# Altium project X1000_BB.PrjPCB
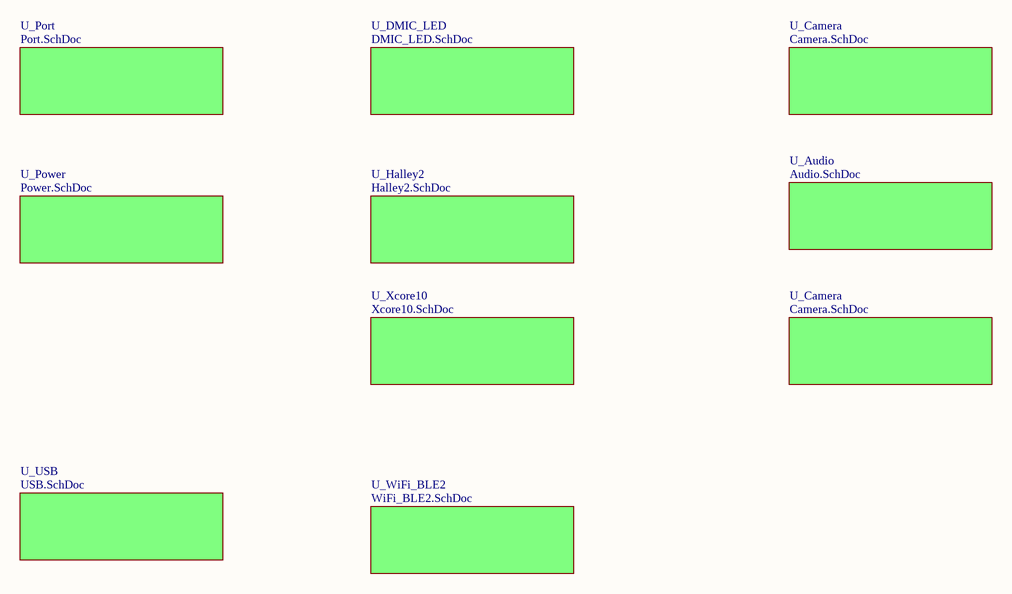
[diagram p0: X1000_BB.SchDoc]
10 sheets, 77 parts. Net scope: global (net labels, ports and power ports of the same name join across sheets).
Board file: X1000_BB.PcbDoc
Sheets:
  X1000_BB.SchDoc
    U_Camera = Camera.SchDoc
    U_Audio = Audio.SchDoc
    U_Camera = Camera.SchDoc
    U_DMIC_LED = DMIC_LED.SchDoc
    U_Halley2 = Halley2.SchDoc
    U_Port = Port.SchDoc
    U_Power = Power.SchDoc
    U_USB = USB.SchDoc
    U_WiFi_BLE2 = WiFi_BLE2.SchDoc
    U_Xcore10 = Xcore10.SchDoc

## Sheet X1000_BB.SchDoc
size A

### Sub-sheets
U_Audio = Audio.SchDoc: no entries
U_Camera = Camera.SchDoc: no entries
U_Camera = Camera.SchDoc: no entries
U_DMIC_LED = DMIC_LED.SchDoc: no entries
U_Halley2 = Halley2.SchDoc: no entries
U_Port = Port.SchDoc: no entries
U_Power = Power.SchDoc: no entries
U_USB = USB.SchDoc: no entries
U_WiFi_BLE2 = WiFi_BLE2.SchDoc: no entries
U_Xcore10 = Xcore10.SchDoc: no entries

## Sheet Camera.SchDoc
size A
Used 2 times, as channels U_Camera, U_Camera. Parts and nets are listed once, with the designators drawn on the sheet.
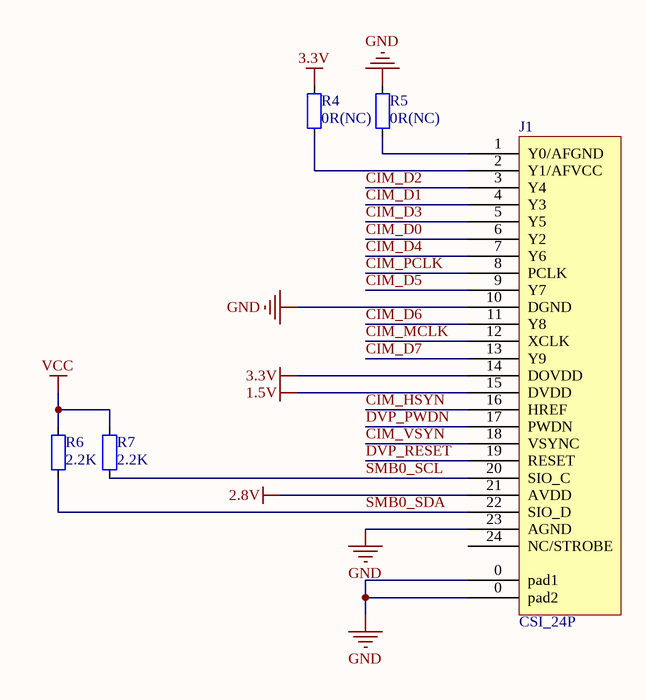
[diagram p1: Camera.SchDoc]

### Parts
J1  CSI_24P  [FFC_0.5_24]
R4  value 0R(NC)  [RES_0402]  (hidden comment: Res_0402)
R5  value 0R(NC)  [RES_0402]  (hidden comment: Res_0402)
R6  value 2.2K  [RES_0402]  (hidden comment: Res_0402)
R7  value 2.2K  [RES_0402]  (hidden comment: Res_0402)

### Nets
1.5V: J1.15(DVDD)
2.8V: J1.21(AVDD)
3.3V: J1.14(DOVDD) R4.2
GND: J1.0(pad1) J1.10(DGND) J1.23(AGND) R5.2
VCC: R6.2 R7.2
CIM_D0: J1.6(Y2)
CIM_D1: J1.4(Y3)
CIM_D2: J1.3(Y4)
CIM_D3: J1.5(Y5)
CIM_D4: J1.7(Y6)
CIM_D5: J1.9(Y7)
CIM_D6: J1.11(Y8)
CIM_D7: J1.13(Y9)
CIM_HSYN: J1.16(HREF)
CIM_MCLK: J1.12(XCLK)
CIM_PCLK: J1.8(PCLK)
CIM_VSYN: J1.18(VSYNC)
DVP_PWDN: J1.17(PWDN)
DVP_RESET: J1.19(RESET)
SMB0_SCL: J1.20(SIO_C) R7.1
SMB0_SDA: J1.22(SIO_D) R6.1
NetJ1_1: J1.1(Y0/AFGND) R5.1
NetJ1_2: J1.2(Y1/AFVCC) R4.1

Not connected (* = marked no-connect by the designer): J1 24(NC/STROBE)

### Channels
U_Camera: designators end in _U_Camera#1
U_Camera: designators end in _U_Camera#2

### Library data of the parts
R4-R7 = Res_0402: Resistor

## Sheet Audio.SchDoc
size A
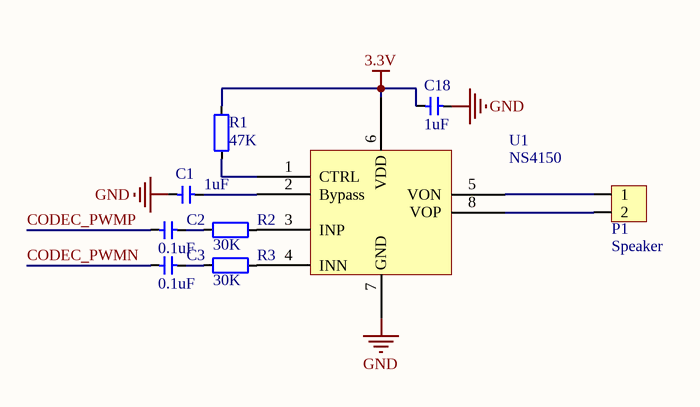
[diagram p2: Audio.SchDoc]

### Parts
C1  value 1uF  [CAP_0402]  (hidden comment: Cap_0402)
C2  value 0.1uF  [CAP_0402]  (hidden comment: Cap_0402)
C3  value 0.1uF  [CAP_0402]  (hidden comment: Cap_0402)
C18  value 1uF  [CAP_0402]  (hidden comment: Cap_0402)
P1  Speaker  [HDR1X2_2.54_180]
R1  value 47K  [RES_0402]  (hidden comment: Res_0402)
R2  value 30K  [RES_0402]  (hidden comment: Res_0402)
R3  value 30K  [RES_0402]  (hidden comment: Res_0402)
U1  NS4150  [SOP_E150_8]

### Nets
3.3V: C18.2 R1.2 U1.6(VDD)
GND: C1.1 C18.1
CODEC_PWMN: C3.1
CODEC_PWMP: C2.1
NetC1_2: C1.2 U1.2(Bypass)
NetC2_2: C2.2 R2.2
NetC3_2: C3.2 R3.2
NetP1_1: P1.1 U1.5(VON)
NetP1_2: P1.2 U1.8(VOP)
NetR1_1: R1.1 U1.1(CTRL)
NetR2_1: R2.1 U1.3(INP)
NetR3_1: R3.1 U1.4(INN)

Not connected (* = marked no-connect by the designer): U1 7(GND)

### Notes on the sheet
- Labels drawn without touching a wire or pin: GND

### Library data of the parts
C1-C3 C18 = Cap_0402: Capacitor
P1 = HDR1x2_2.54: Header
R1-R3 = Res_0402: Resistor
U1 = NS4150: D Class Audio Amp

## Sheet DMIC_LED.SchDoc
size A
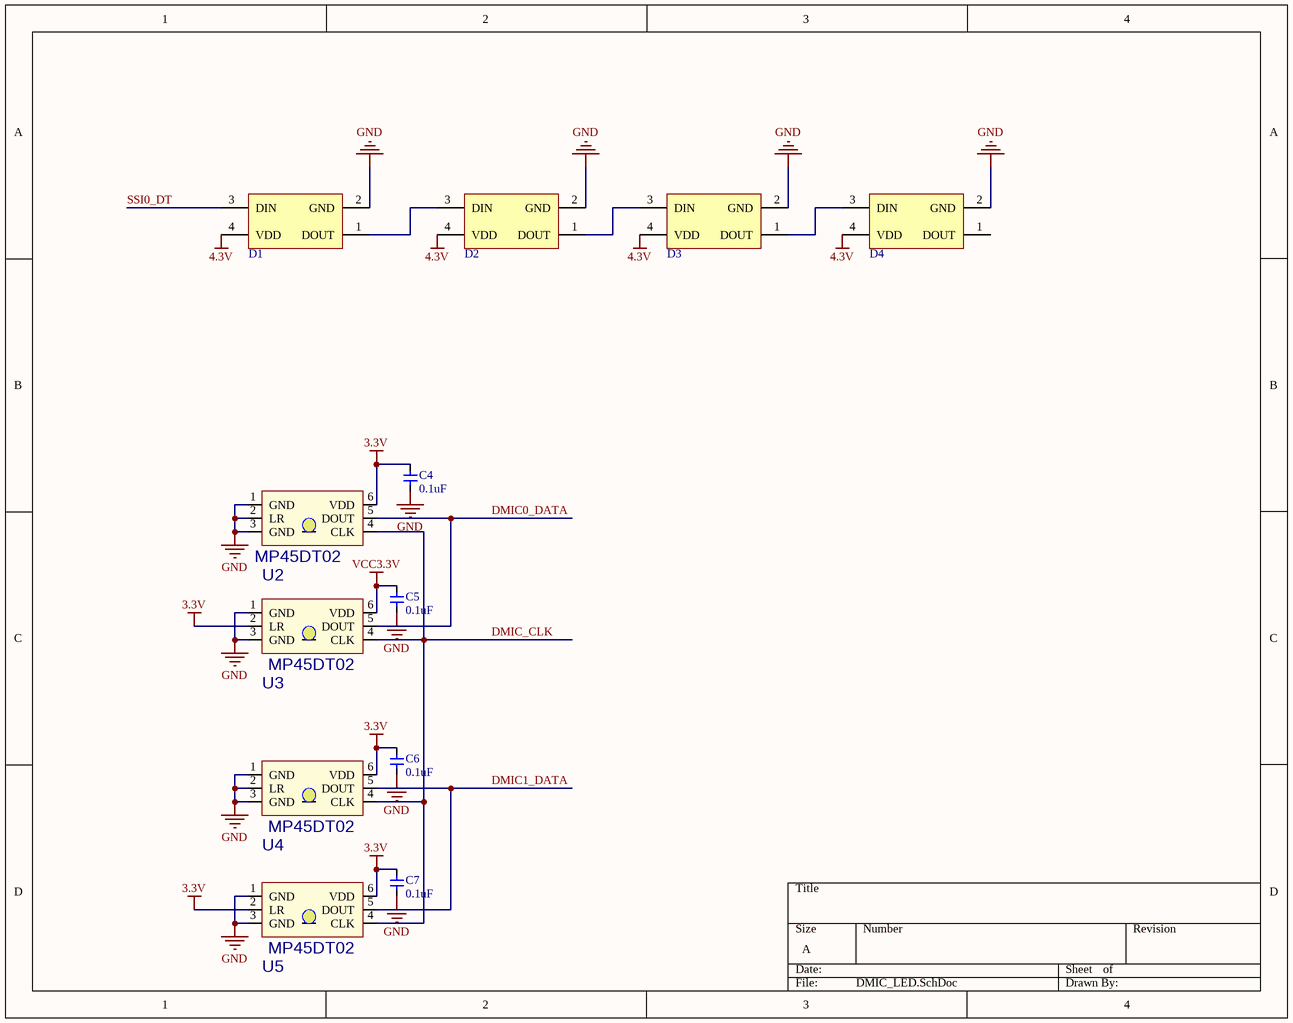
[diagram p3: DMIC_LED.SchDoc]

### Parts
C4  value 0.1uF  [CAP_0603]  (hidden comment: Cap_0603)
C5  value 0.1uF  [CAP_0603]  (hidden comment: Cap_0603)
C6  value 0.1uF  [CAP_0603]  (hidden comment: Cap_0603)
C7  value 0.1uF  [CAP_0603]  (hidden comment: Cap_0603)
D1  LED_3535_SK6812  [LED_3535_4P]  (value not drawn)
D2  LED_3535_SK6812  [LED_3535_4P]  (value not drawn)
D3  LED_3535_SK6812  [LED_3535_4P]  (value not drawn)
D4  LED_3535_SK6812  [LED_3535_4P]  (value not drawn)
U2  MP45DT02  [ST_HLGA6]
U3  MP45DT02  [ST_HLGA6]
U4  MP45DT02  [ST_HLGA6]
U5  MP45DT02  [ST_HLGA6]

### Nets
3.3V: C4.2 C6.2 C7.2 U2.6(VDD) U3.2(LR) U4.6(VDD) U5.2(LR) U5.6(VDD)
4.3V: D1.4(VDD) D2.4(VDD) D3.4(VDD) D4.4(VDD)
GND: C4.1 C5.1 C6.1 C7.1 D1.2(GND) D2.2(GND) D3.2(GND) D4.2(GND) U2.1(GND) U2.2(LR) U2.3(GND) U3.1(GND) U3.3(GND) U4.1(GND) U4.2(LR) U4.3(GND) U5.1(GND) U5.3(GND)
VCC3.3V: C5.2 U3.6(VDD)
DMIC0_DATA: U2.5(DOUT) U3.5(DOUT)
DMIC1_DATA: U4.5(DOUT) U5.5(DOUT)
DMIC_CLK: U2.4(CLK) U3.4(CLK) U4.4(CLK) U5.4(CLK)
SSI0_DT: D1.3(DIN)
NetD1_1: D1.1(DOUT) D2.3(DIN)
NetD2_1: D2.1(DOUT) D3.3(DIN)
NetD3_1: D3.1(DOUT) D4.3(DIN)

Not connected (* = marked no-connect by the designer): D4 1(DOUT)

### Library data of the parts
C4-C7 = Cap_0603: Capacitor
D1-D4 = LED_3535_SK6812: LED
U2-U5 = MP45DT02: Mic Omni-Directional -26dB 3.6V Rectangular Solder Pad; MF: STMicroelectronics; MP: MP45DT02; Package: None; Availability: Good; Price: 2.57 USD; Value: *

## Sheet Halley2.SchDoc
size A
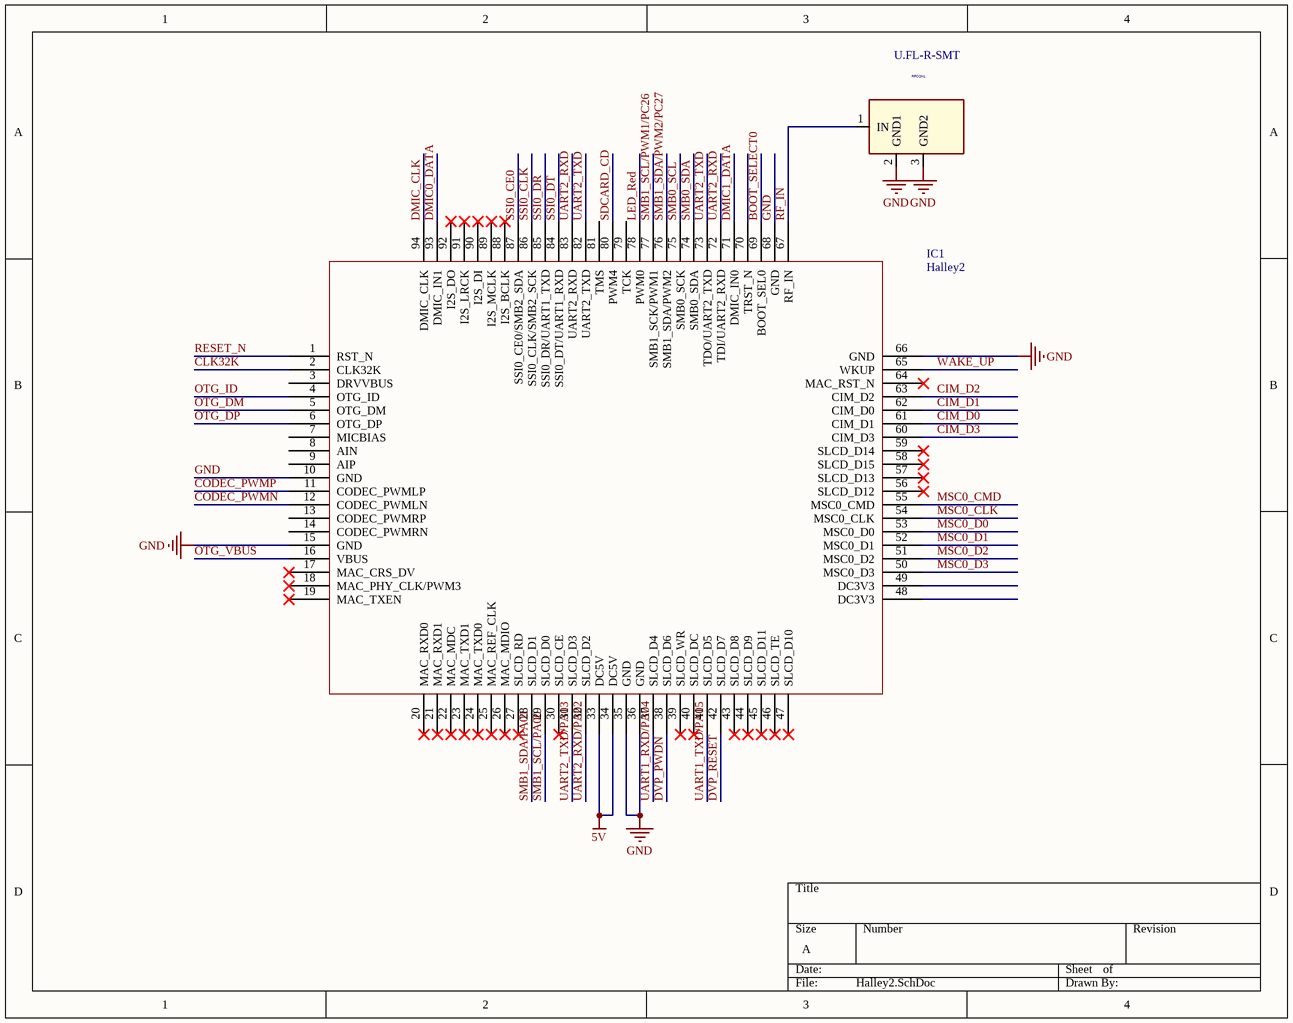
[diagram p4: Halley2.SchDoc]

### Parts
IC1  Halley2  [Halley2]
RFCON1  U.FL-R-SMT  [ANTENNA_DN007N]

### Nets
5V: IC1.33(DC5V) IC1.34(DC5V)
GND: IC1.10(GND) IC1.15(GND) IC1.35(GND) IC1.36(GND) IC1.66(GND) IC1.68(GND) RFCON1.2(GND1) RFCON1.3(GND2)
OTG_VBUS: IC1.16(VBUS)
BOOT_SELECT0: IC1.69(BOOT_SEL0)
CIM_D0: IC1.61(CIM_D1)
CIM_D1: IC1.62(CIM_D0)
CIM_D2: IC1.63(CIM_D2)
CIM_D3: IC1.60(CIM_D3)
CLK32K: IC1.2(CLK32K)
CODEC_PWMN: IC1.12(CODEC_PWMLN)
CODEC_PWMP: IC1.11(CODEC_PWMLP)
DMIC0_DATA: IC1.93(DMIC_IN1)
DMIC1_DATA: IC1.71(DMIC_IN0)
DMIC_CLK: IC1.94(DMIC_CLK)
DVP_PWDN: IC1.38(SLCD_D6)
DVP_RESET: IC1.42(SLCD_D7)
LED_Red: IC1.78(PWM0)
MSC0_CLK: IC1.54(MSC0_CLK)
MSC0_CMD: IC1.55(MSC0_CMD)
MSC0_D0: IC1.53(MSC0_D0)
MSC0_D1: IC1.52(MSC0_D1)
MSC0_D2: IC1.51(MSC0_D2)
MSC0_D3: IC1.50(MSC0_D3)
OTG_DM: IC1.5(OTG_DM)
OTG_DP: IC1.6(OTG_DP)
OTG_ID: IC1.4(OTG_ID)
RESET_N: IC1.1(RST_N)
RF_IN: IC1.67(RF_IN) RFCON1.1(IN)
SDCARD_CD: IC1.80(PWM4)
SMB0_SCL: IC1.75(SMB0_SCK)
SMB0_SDA: IC1.74(SMB0_SDA)
SMB1_SCL/PA00: IC1.29(SLCD_D0)
SMB1_SCL/PWM1/PC26: IC1.77(SMB1_SCK/PWM1)
SMB1_SDA/PA01: IC1.28(SLCD_D1)
SMB1_SDA/PWM2/PC27: IC1.76(SMB1_SDA/PWM2)
SSI0_CE0: IC1.87(SSI0_CE0/SMB2_SDA)
SSI0_CLK: IC1.86(SSI0_CLK/SMB2_SCK)
SSI0_DR: IC1.85(SSI0_DR/UART1_TXD)
SSI0_DT: IC1.84(SSI0_DT/UART1_RXD)
UART1_RXD/PA04: IC1.37(SLCD_D4)
UART1_TXD/PA05: IC1.41(SLCD_D5)
UART2_RXD: IC1.72(TDI/UART2_RXD) IC1.83(UART2_RXD)
UART2_RXD/PA02: IC1.32(SLCD_D2)
UART2_TXD: IC1.73(TDO/UART2_TXD) IC1.82(UART2_TXD)
UART2_TXD/PA03: IC1.31(SLCD_D3)
WAKE_UP: IC1.65(WKUP)

Not connected (* = marked no-connect by the designer): IC1 3(DRVVBUS) 7(MICBIAS) 8(AIN) 9(AIP) 13(CODEC_PWMRP) 14(CODEC_PWMRN) 17(MAC_CRS_DV)* 18(MAC_PHY_CLK/PWM3)* 19(MAC_TXEN)* 20(MAC_RXD0)* 21(MAC_RXD1)* 22(MAC_MDC)* 23(MAC_TXD1)* 24(MAC_TXD0)* 25(MAC_REF_CLK)* 26(MAC_MDIO)* 27(SLCD_RD)* 30(SLCD_CE)* 39(SLCD_WR)* 40(SLCD_DC)* 43(SLCD_D8)* 44(SLCD_D9)* 45(SLCD_D11)* 46(SLCD_TE)* 47(SLCD_D10)* 48(DC3V3) 49(DC3V3) 56(SLCD_D12)* 57(SLCD_D13)* 58(SLCD_D15)* 59(SLCD_D14)* 64(MAC_RST_N)* 70(TRST_N) 79(TCK) 81(TMS) 88(I2S_BCLK)* 89(I2S_MCLK)* 90(I2S_DI)* 91(I2S_LRCK)* 92(I2S_DO)*

### Library data of the parts
RFCON1 = ANT_0: 1ST PART DESCRIPTION: U.FL-R-SMT

## Sheet Port.SchDoc
size A
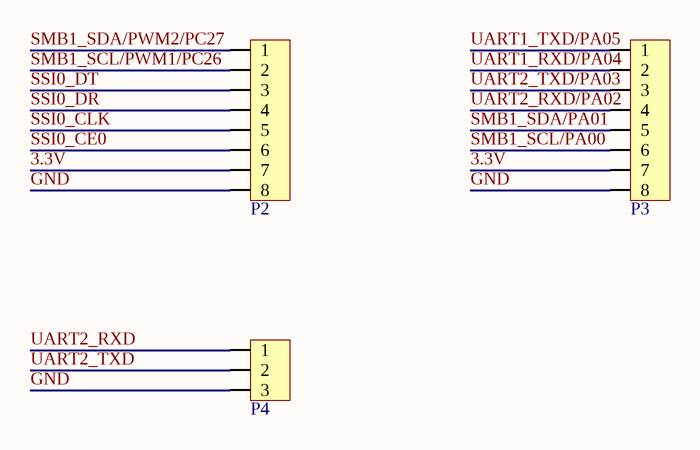
[diagram p5: Port.SchDoc]

### Parts
P2  HDR1x8_2.54  [HDR1X8_2.54_180]  (value not drawn)
P3  HDR1x8_2.54  [HDR1X8_2.54_180]  (value not drawn)
P4  HDR1x3_2.54  [HDR1X3_2.54_180]  (value not drawn)

### Nets
3.3V: P2.7 P3.7
GND: P2.8 P3.8 P4.3
SMB1_SCL/PA00: P3.6
SMB1_SCL/PWM1/PC26: P2.2
SMB1_SDA/PA01: P3.5
SMB1_SDA/PWM2/PC27: P2.1
SSI0_CE0: P2.6
SSI0_CLK: P2.5
SSI0_DR: P2.4
SSI0_DT: P2.3
UART1_RXD/PA04: P3.2
UART1_TXD/PA05: P3.1
UART2_RXD: P4.1
UART2_RXD/PA02: P3.4
UART2_TXD: P4.2
UART2_TXD/PA03: P3.3

### Library data of the parts
P2 P3 = HDR1x8_2.54: Header
P4 = HDR1x3_2.54: Header

## Sheet Power.SchDoc
size A
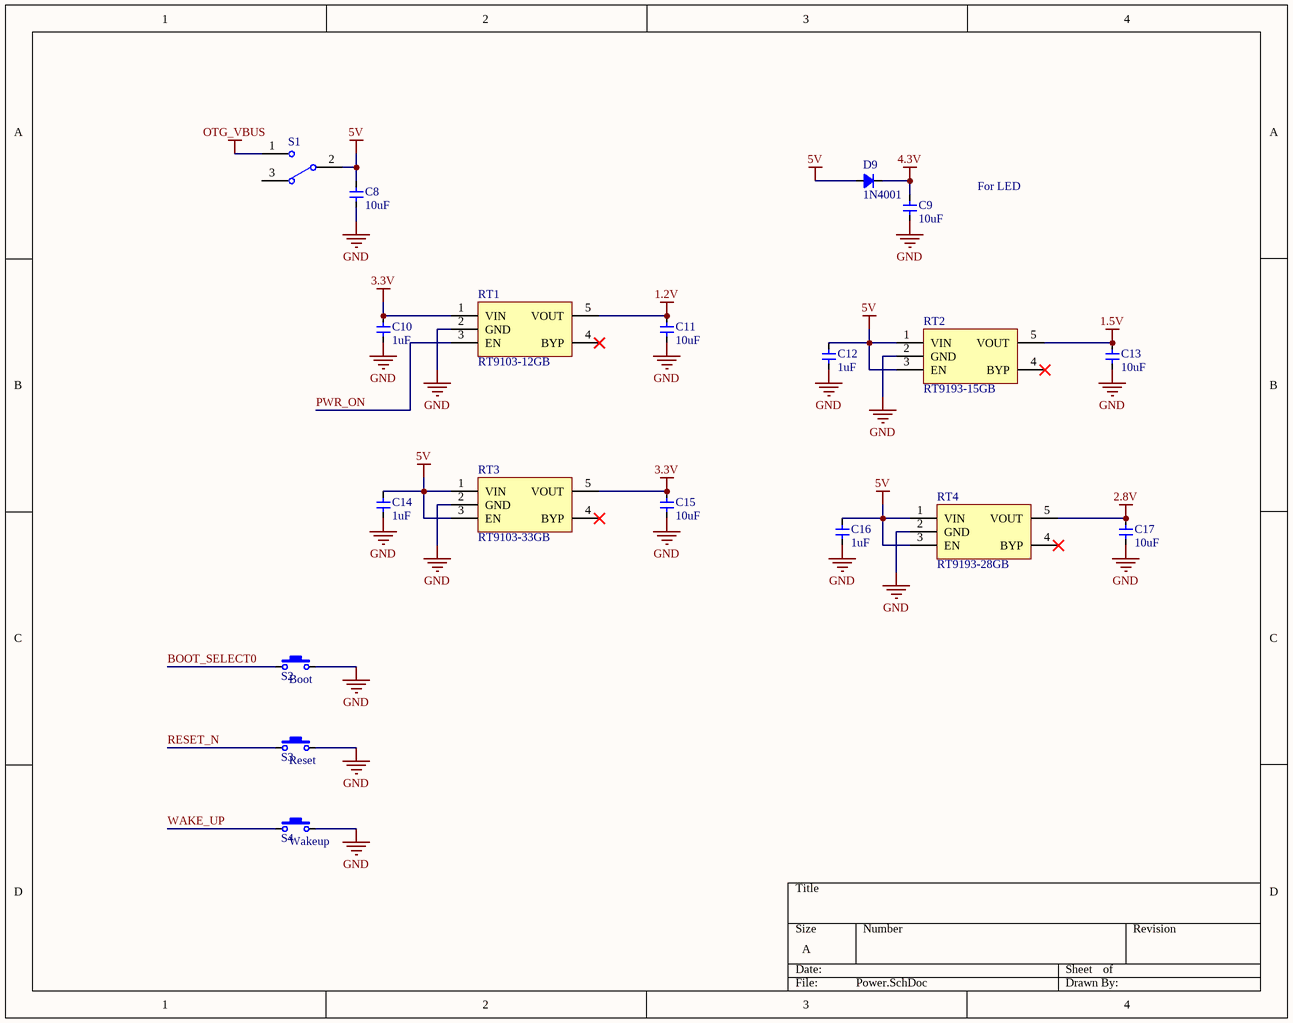
[diagram p6: Power.SchDoc]

### Parts
C8  value 10uF  [CAP_0805]  (hidden comment: Cap_0805)
C9  value 10uF  [CAP_0805]  (hidden comment: Cap_0805)
C10  value 1uF  [CAP_0402]  (hidden comment: Cap_0402)
C11  value 10uF  [CAP_0805]  (hidden comment: Cap_0805)
C12  value 1uF  [CAP_0402]  (hidden comment: Cap_0402)
C13  value 10uF  [CAP_0805]  (hidden comment: Cap_0805)
C14  value 1uF  [CAP_0402]  (hidden comment: Cap_0402)
C15  value 10uF  [CAP_0805]  (hidden comment: Cap_0805)
C16  value 1uF  [CAP_0402]  (hidden comment: Cap_0402)
C17  value 10uF  [CAP_0805]  (hidden comment: Cap_0805)
D9  value 1N4001  [DO-214AC]  (hidden comment: IN4001)
RT1  RT9103-12GB  [SOT23-5]
RT2  RT9193-15GB  [SOT23-5]
RT3  RT9103-33GB  [SOT23-5]
RT4  RT9193-28GB  [SOT23-5]
S1  SwitchSPDT_2.8x6.6_90  [SwitchSPDT_2.8X6.6_90]  (value not drawn)
S2  Boot  [ButtonTACT_3x4x2_180H]
S3  Reset  [ButtonTACT_3x4x2_180H]
S4  Wakeup  [ButtonTACT_3x4x2_180H]

### Nets
1.2V: C11.2 RT1.5(VOUT)
1.5V: C13.2 RT2.5(VOUT)
2.8V: C17.2 RT4.5(VOUT)
3.3V: C10.2 C15.2 RT1.1(VIN) RT3.5(VOUT)
4.3V: C9.2 D9.2(K)
5V: C8.2 C12.2 C14.2 C16.2 D9.1(A) RT2.1(VIN) RT2.3(EN) RT3.1(VIN) RT3.3(EN) RT4.1(VIN) RT4.3(EN) S1.2
GND: C8.1 C9.1 C10.1 C11.1 C12.1 C13.1 C14.1 C15.1 C16.1 C17.1 RT1.2(GND) RT2.2(GND) RT3.2(GND) RT4.2(GND) S2.2 S3.2 S4.2
OTG_VBUS: S1.1
BOOT_SELECT0: S2.1
PWR_ON: RT1.3(EN)
RESET_N: S3.1
WAKE_UP: S4.1

Not connected (* = marked no-connect by the designer): RT1 4(BYP)*; RT2 4(BYP)*; RT3 4(BYP)*; RT4 4(BYP)*; S1 3

### Notes on the sheet
- For LED

### Library data of the parts
C8 C9 C11 C13 C15 C17 = Cap_0805: Capacitor
C10 C12 C14 C16 = Cap_0402: Capacitor
D9 = Diode_SMA: Diode
RT1-RT4 = RT9193: Power
S1 = SwitchSPDT_2.8x6.6_90: Switch
S2-S4 = ButtonTACT_3x4x2_180: Button

## Sheet USB.SchDoc
size A
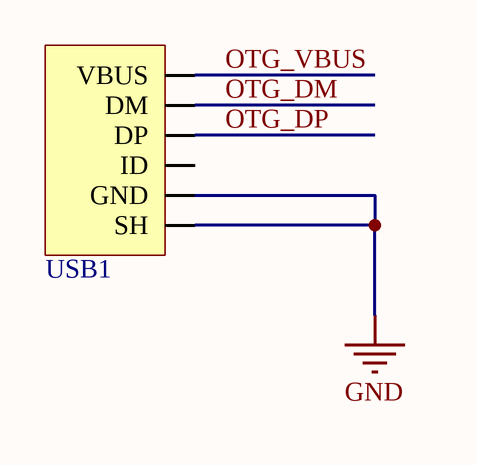
[diagram p7: USB.SchDoc]

### Parts
USB1  USB_Micro  [USB_Micro-AB]  (value not drawn)

### Nets
GND: USB1.0(SH) USB1.5(GND)
OTG_VBUS: USB1.1(VBUS)
OTG_DM: USB1.2(DM)
OTG_DP: USB1.3(DP)

Not connected (* = marked no-connect by the designer): USB1 4(ID)

### Library data of the parts
USB1 = USB_Micro: USB

## Sheet WiFi_BLE2.SchDoc
size A
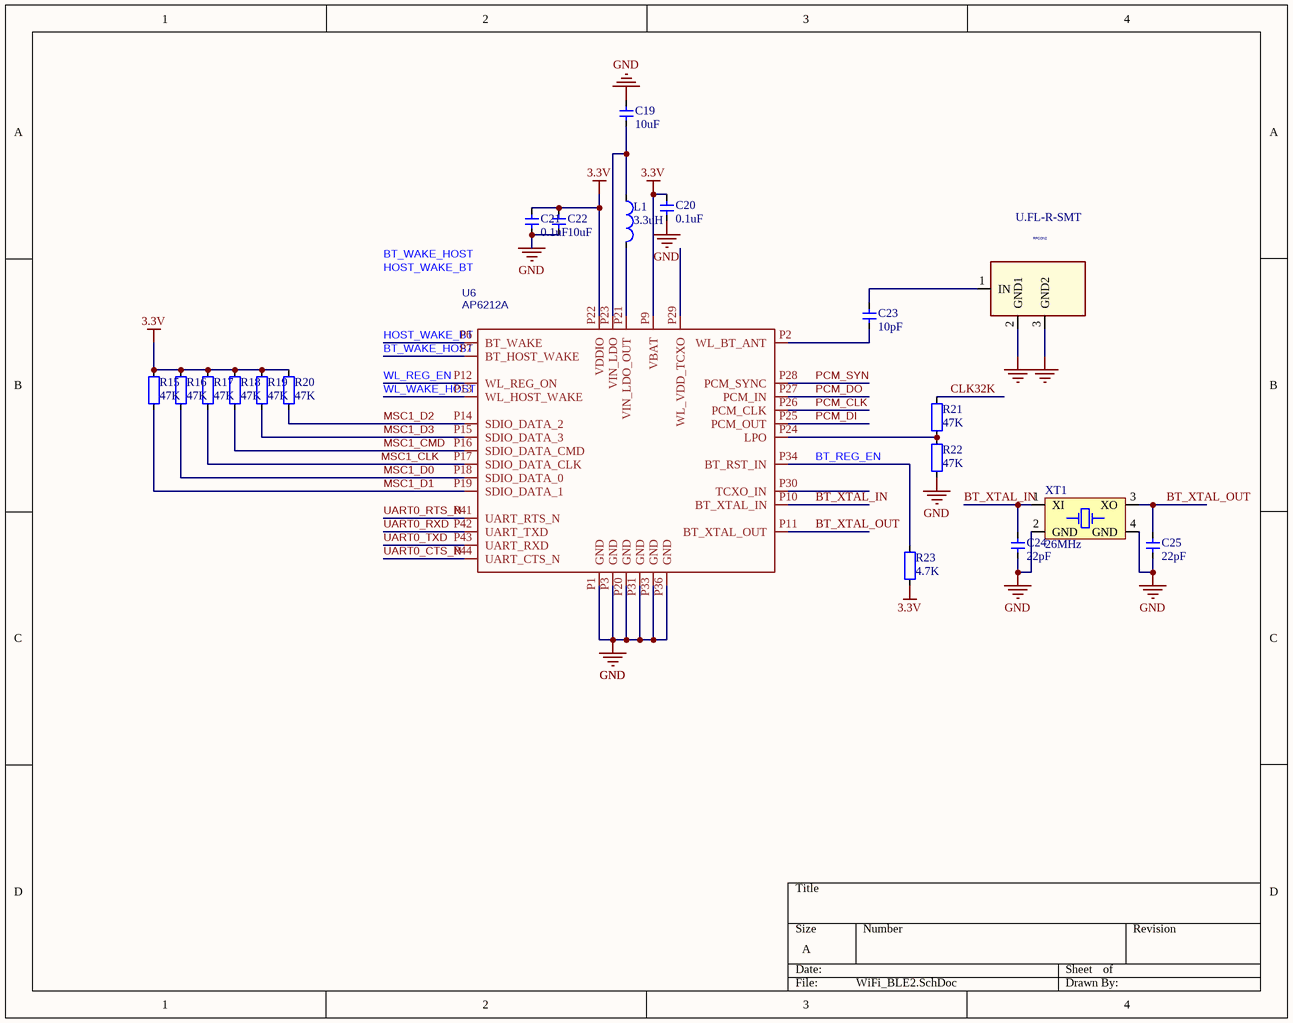
[diagram p8: WiFi_BLE2.SchDoc]

### Parts
C19  value 10uF  [CAP_0805]  (hidden comment: Cap_0805)
C20  value 0.1uF  [CAP_0402]  (hidden comment: Cap_0402)
C21  value 0.1uF  [CAP_0402]  (hidden comment: Cap_0402)
C22  value 10uF  [CAP_0805]  (hidden comment: Cap_0805)
C23  value 10pF  [CAP_0402]  (hidden comment: Cap_0402)
C24  value 22pF  [CAP_0402]  (hidden comment: Cap_0402)
C25  value 22pF  [CAP_0402]  (hidden comment: Cap_0402)
L1  value 3.3uH  [IND_0402]  (hidden comment: Ind_0402)
R15  value 47K  [RES_0402]  (hidden comment: Res_0402)
R16  value 47K  [RES_0402]  (hidden comment: Res_0402)
R17  value 47K  [RES_0402]  (hidden comment: Res_0402)
R18  value 47K  [RES_0402]  (hidden comment: Res_0402)
R19  value 47K  [RES_0402]  (hidden comment: Res_0402)
R20  value 47K  [RES_0402]  (hidden comment: Res_0402)
R21  value 47K  [RES_0402]  (hidden comment: Res_0402)
R22  value 47K  [RES_0402]  (hidden comment: Res_0402)
R23  value 4.7K  [RES_0402]  (hidden comment: Res_0402)
RFCON2  U.FL-R-SMT  [ANTENNA_DN007N]
U6  AP6212A  [AP6210]
XT1  value 26MHz  [XT_3225_4]  (hidden comment: XTAL_3225_4P)

### Nets
3.3V: C20.2 C21.2 C22.2 R15.2 R16.2 R17.2 R18.2 R19.2 R20.2 R23.1 U6.P9(VBAT) U6.P22(VDDIO)
GND: C19.2 C20.1 C21.1 C22.1 C24.1 C25.1 R22.1 RFCON2.2(GND1) RFCON2.3(GND2) U6.P1(GND) U6.P3(GND) U6.P20(GND) U6.P31(GND) U6.P33(GND) U6.P36(GND) XT1.2(GND) XT1.4(GND)
BT_REG_EN: R23.2 U6.P34(BT_RST_IN)
BT_WAKE_HOST: U6.P7(BT_HOST_WAKE)
BT_XTAL_IN: C24.2 U6.P10(BT_XTAL_IN) XT1.1(XI)
BT_XTAL_OUT: C25.2 U6.P11(BT_XTAL_OUT) XT1.3(XO)
CLK32K: R21.2
HOST_WAKE_BT: U6.P6(BT_WAKE)
MSC1_CLK: R17.1 U6.P17(SDIO_DATA_CLK)
MSC1_CMD: R18.1 U6.P16(SDIO_DATA_CMD)
MSC1_D0: R16.1 U6.P18(SDIO_DATA_0)
MSC1_D1: R15.1 U6.P19(SDIO_DATA_1)
MSC1_D2: R20.1 U6.P14(SDIO_DATA_2)
MSC1_D3: R19.1 U6.P15(SDIO_DATA_3)
PCM_CLK: U6.P26(PCM_CLK)
PCM_DI: U6.P25(PCM_OUT)
PCM_DO: U6.P27(PCM_IN)
PCM_SYN: U6.P28(PCM_SYNC)
UART0_CTS_N: U6.P44(UART_CTS_N)
UART0_RTS_N: U6.P41(UART_RTS_N)
UART0_RXD: U6.P42(UART_TXD)
UART0_TXD: U6.P43(UART_RXD)
WL_REG_EN: U6.P12(WL_REG_ON)
WL_WAKE_HOST: U6.P13(WL_HOST_WAKE)
NetC19_1: C19.1 L1.1 U6.P23(VIN_LDO)
NetC23_1: C23.1 U6.P2(WL_BT_ANT)
NetC23_2: C23.2 RFCON2.1(IN)
NetL1_2: L1.2 U6.P21(VIN_LDO_OUT)
NetR21_1: R21.1 R22.2 U6.P24(LPO)

Not connected (* = marked no-connect by the designer): U6 P29(WL_VDD_TCXO) P30(TCXO_IN)

### Notes on the sheet
- Labels drawn without touching a wire or pin: BT_WAKE_HOST, HOST_WAKE_BT

### Library data of the parts
C19 C22 = Cap_0805: Capacitor
C20 C21 C23-C25 = Cap_0402: Capacitor
L1 = Ind_0402: Inductor
R15-R23 = Res_0402: Resistor
RFCON2 = ANT_0: 1ST PART DESCRIPTION: U.FL-R-SMT
U6 = AP6210: timeStamp: 1455127572; BOM_Manufacturer Part: ?; spicePre: U
XT1 = XTAL_3225_4P: Crystal Oscillator

## Sheet Xcore10.SchDoc
size A
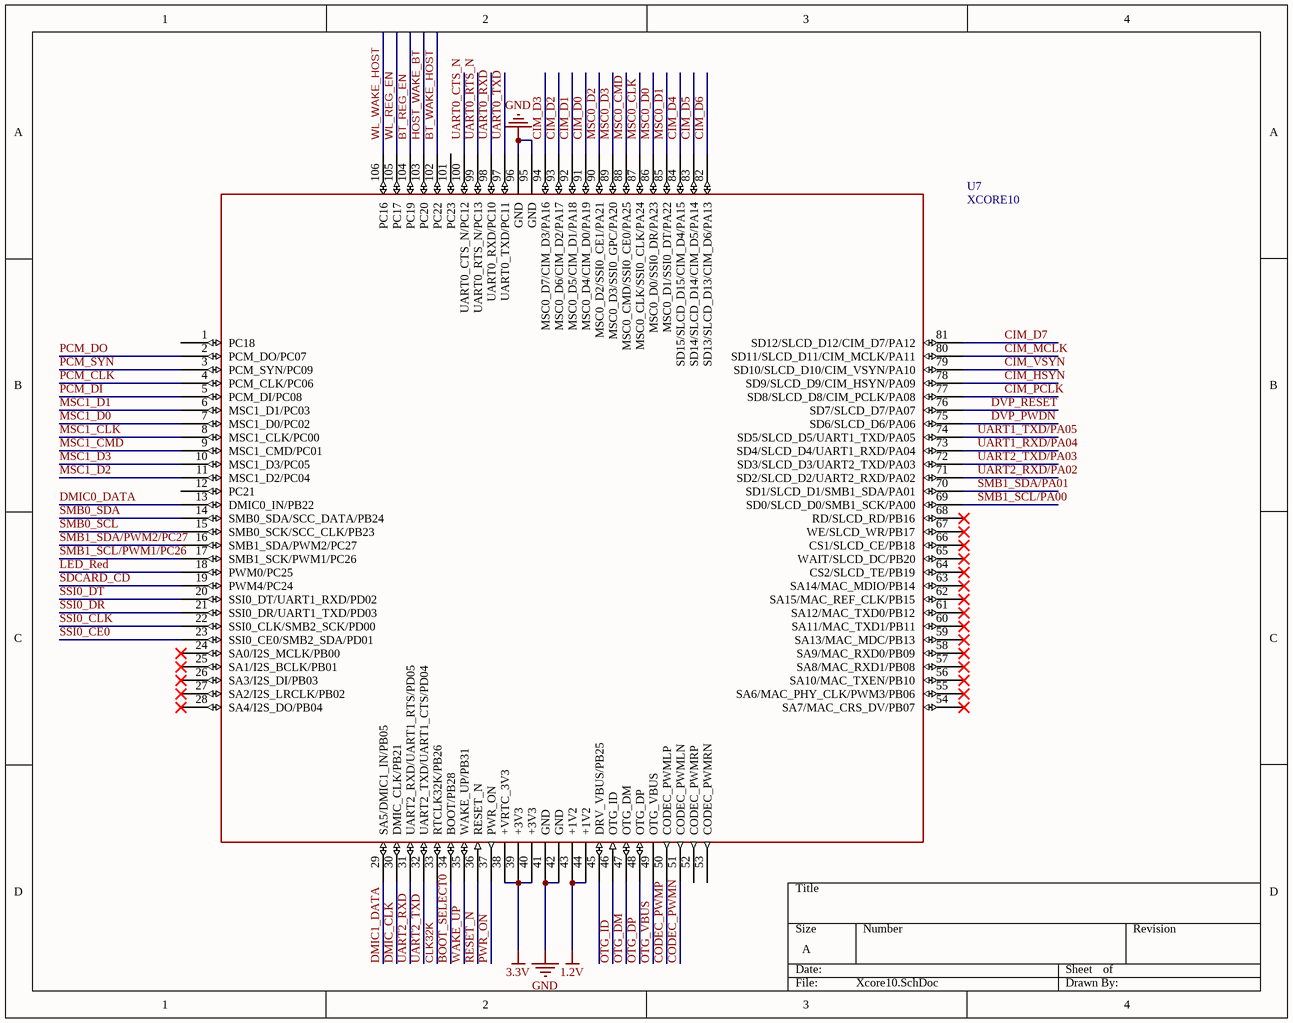
[diagram p9: Xcore10.SchDoc]

### Parts
U7  XCORE10  [CORE-32*26-1.0]

### Nets
1.2V: U7.43(+1V2) U7.44(+1V2)
3.3V: U7.38(+VRTC_3V3) U7.39(+3V3) U7.40(+3V3)
GND: U7.41(GND) U7.42(GND) U7.95(GND) U7.96(GND)
OTG_VBUS: U7.49(OTG_VBUS)
BOOT_SELECT0: U7.34(BOOT/PB28)
BT_REG_EN: U7.104(PC19)
BT_WAKE_HOST: U7.102(PC22)
CIM_D0: U7.91(MSC0_D4/CIM_D0/PA19)
CIM_D1: U7.92(MSC0_D5/CIM_D1/PA18)
CIM_D2: U7.93(MSC0_D6/CIM_D2/PA17)
CIM_D3: U7.94(MSC0_D7/CIM_D3/PA16)
CIM_D4: U7.84(SD15/SLCD_D15/CIM_D4/PA15)
CIM_D5: U7.83(SD14/SLCD_D14/CIM_D5/PA14)
CIM_D6: U7.82(SD13/SLCD_D13/CIM_D6/PA13)
CIM_D7: U7.81(SD12/SLCD_D12/CIM_D7/PA12)
CIM_HSYN: U7.78(SD9/SLCD_D9/CIM_HSYN/PA09)
CIM_MCLK: U7.80(SD11/SLCD_D11/CIM_MCLK/PA11)
CIM_PCLK: U7.77(SD8/SLCD_D8/CIM_PCLK/PA08)
CIM_VSYN: U7.79(SD10/SLCD_D10/CIM_VSYN/PA10)
CLK32K: U7.33(RTCLK32K/PB26)
CODEC_PWMN: U7.51(CODEC_PWMLN)
CODEC_PWMP: U7.50(CODEC_PWMLP)
DMIC0_DATA: U7.13(DMIC0_IN/PB22)
DMIC1_DATA: U7.29(SA5/DMIC1_IN/PB05)
DMIC_CLK: U7.30(DMIC_CLK/PB21)
DVP_PWDN: U7.75(SD6/SLCD_D6/PA06)
DVP_RESET: U7.76(SD7/SLCD_D7/PA07)
HOST_WAKE_BT: U7.103(PC20)
LED_Red: U7.18(PWM0/PC25)
MSC0_CLK: U7.87(MSC0_CLK/SSI0_CLK/PA24)
MSC0_CMD: U7.88(MSC0_CMD/SSI0_CE0/PA25)
MSC0_D0: U7.86(MSC0_D0/SSI0_DR/PA23)
MSC0_D1: U7.85(MSC0_D1/SSI0_DT/PA22)
MSC0_D2: U7.90(MSC0_D2/SSI0_CE1/PA21)
MSC0_D3: U7.89(MSC0_D3/SSI0_GPC/PA20)
MSC1_CLK: U7.8(MSC1_CLK/PC00)
MSC1_CMD: U7.9(MSC1_CMD/PC01)
MSC1_D0: U7.7(MSC1_D0/PC02)
MSC1_D1: U7.6(MSC1_D1/PC03)
MSC1_D2: U7.11(MSC1_D2/PC04)
MSC1_D3: U7.10(MSC1_D3/PC05)
OTG_DM: U7.47(OTG_DM)
OTG_DP: U7.48(OTG_DP)
OTG_ID: U7.46(OTG_ID)
PCM_CLK: U7.4(PCM_CLK/PC06)
PCM_DI: U7.5(PCM_DI/PC08)
PCM_DO: U7.2(PCM_DO/PC07)
PCM_SYN: U7.3(PCM_SYN/PC09)
PWR_ON: U7.37(PWR_ON)
RESET_N: U7.36(RESET_N)
SDCARD_CD: U7.19(PWM4/PC24)
SMB0_SCL: U7.15(SMB0_SCK/SCC_CLK/PB23)
SMB0_SDA: U7.14(SMB0_SDA/SCC_DATA/PB24)
SMB1_SCL/PA00: U7.69(SD0/SLCD_D0/SMB1_SCK/PA00)
SMB1_SCL/PWM1/PC26: U7.17(SMB1_SCK/PWM1/PC26)
SMB1_SDA/PA01: U7.70(SD1/SLCD_D1/SMB1_SDA/PA01)
SMB1_SDA/PWM2/PC27: U7.16(SMB1_SDA/PWM2/PC27)
SSI0_CE0: U7.23(SSI0_CE0/SMB2_SDA/PD01)
SSI0_CLK: U7.22(SSI0_CLK/SMB2_SCK/PD00)
SSI0_DR: U7.21(SSI0_DR/UART1_TXD/PD03)
SSI0_DT: U7.20(SSI0_DT/UART1_RXD/PD02)
UART0_CTS_N: U7.100(UART0_CTS_N/PC12)
UART0_RTS_N: U7.99(UART0_RTS_N/PC13)
UART0_RXD: U7.98(UART0_RXD/PC10)
UART0_TXD: U7.97(UART0_TXD/PC11)
UART1_RXD/PA04: U7.73(SD4/SLCD_D4/UART1_RXD/PA04)
UART1_TXD/PA05: U7.74(SD5/SLCD_D5/UART1_TXD/PA05)
UART2_RXD: U7.31(UART2_RXD/UART1_RTS/PD05)
UART2_RXD/PA02: U7.71(SD2/SLCD_D2/UART2_RXD/PA02)
UART2_TXD: U7.32(UART2_TXD/UART1_CTS/PD04)
UART2_TXD/PA03: U7.72(SD3/SLCD_D3/UART2_TXD/PA03)
WAKE_UP: U7.35(WAKE_UP/PB31)
WL_REG_EN: U7.105(PC17)
WL_WAKE_HOST: U7.106(PC16)

Not connected (* = marked no-connect by the designer): U7 1(PC18) 12(PC21) 24(SA0/I2S_MCLK/PB00)* 25(SA1/I2S_BCLK/PB01)* 26(SA3/I2S_DI/PB03)* 27(SA2/I2S_LRCLK/PB02)* 28(SA4/I2S_DO/PB04)* 45(DRV_VBUS/PB25) 52(CODEC_PWMRP) 53(CODEC_PWMRN) 54(SA7/MAC_CRS_DV/PB07)* 55(SA6/MAC_PHY_CLK/PWM3/PB06)* 56(SA10/MAC_TXEN/PB10)* 57(SA8/MAC_RXD1/PB08)* 58(SA9/MAC_RXD0/PB09)* 59(SA13/MAC_MDC/PB13)* 60(SA11/MAC_TXD1/PB11)* 61(SA12/MAC_TXD0/PB12)* 62(SA15/MAC_REF_CLK/PB15)* 63(SA14/MAC_MDIO/PB14)* 64(CS2/SLCD_TE/PB19)* 65(WAIT/SLCD_DC/PB20)* 66(CS1/SLCD_CE/PB18)* 67(WE/SLCD_WR/PB17)* 68(RD/SLCD_RD/PB16)* 101(PC23)

## Nets that join several sheets
1.2V: Power (C11.2 RT1.5), Xcore10 (U7.43 U7.44)
1.5V: U_Camera (J1_U_Camera#1.15), U_Camera (J1_U_Camera#2.15), Power (C13.2 RT2.5)
2.8V: U_Camera (J1_U_Camera#1.21), U_Camera (J1_U_Camera#2.21), Power (C17.2 RT4.5)
3.3V: U_Camera (J1_U_Camera#1.14 R4_U_Camera#1.2), Audio (C18.2 R1.2 U1.6), U_Camera (J1_U_Camera#2.14 R4_U_Camera#2.2), DMIC_LED (8 pins), Port (P2.7 P3.7), Power (C10.2 C15.2 RT1.1 RT3.5), WiFi_BLE2 (12 pins), Xcore10 (U7.38 U7.39 U7.40)
4.3V: DMIC_LED (D1.4 D2.4 D3.4 D4.4), Power (C9.2 D9.2)
5V: Halley2 (IC1.33 IC1.34), Power (12 pins)
GND: U_Camera (J1_U_Camera#1.0 J1_U_Camera#1.10 J1_U_Camera#1.23 R5_U_Camera#1.2), Audio (C1.1 C18.1), U_Camera (J1_U_Camera#2.0 J1_U_Camera#2.10 J1_U_Camera#2.23 R5_U_Camera#2.2), DMIC_LED (18 pins), Halley2 (8 pins), Port (P2.8 P3.8 P4.3), Power (17 pins), USB (USB1.0 USB1.5), WiFi_BLE2 (17 pins), Xcore10 (U7.41 U7.42 U7.95 U7.96)
OTG_VBUS: Halley2 (IC1.16), Power (S1.1), USB (USB1.1), Xcore10 (U7.49)
VCC: U_Camera (R6_U_Camera#1.2 R7_U_Camera#1.2), U_Camera (R6_U_Camera#2.2 R7_U_Camera#2.2)
BOOT_SELECT0: Halley2 (IC1.69), Power (S2.1), Xcore10 (U7.34)
BT_REG_EN: WiFi_BLE2 (R23.2 U6.P34), Xcore10 (U7.104)
BT_WAKE_HOST: WiFi_BLE2 (U6.P7), Xcore10 (U7.102)
CIM_D0: U_Camera (J1_U_Camera#1.6), U_Camera (J1_U_Camera#2.6), Halley2 (IC1.61), Xcore10 (U7.91)
CIM_D1: U_Camera (J1_U_Camera#1.4), U_Camera (J1_U_Camera#2.4), Halley2 (IC1.62), Xcore10 (U7.92)
CIM_D2: U_Camera (J1_U_Camera#1.3), U_Camera (J1_U_Camera#2.3), Halley2 (IC1.63), Xcore10 (U7.93)
CIM_D3: U_Camera (J1_U_Camera#1.5), U_Camera (J1_U_Camera#2.5), Halley2 (IC1.60), Xcore10 (U7.94)
CIM_D4: U_Camera (J1_U_Camera#1.7), U_Camera (J1_U_Camera#2.7), Xcore10 (U7.84)
CIM_D5: U_Camera (J1_U_Camera#1.9), U_Camera (J1_U_Camera#2.9), Xcore10 (U7.83)
CIM_D6: U_Camera (J1_U_Camera#1.11), U_Camera (J1_U_Camera#2.11), Xcore10 (U7.82)
CIM_D7: U_Camera (J1_U_Camera#1.13), U_Camera (J1_U_Camera#2.13), Xcore10 (U7.81)
CIM_HSYN: U_Camera (J1_U_Camera#1.16), U_Camera (J1_U_Camera#2.16), Xcore10 (U7.78)
CIM_MCLK: U_Camera (J1_U_Camera#1.12), U_Camera (J1_U_Camera#2.12), Xcore10 (U7.80)
CIM_PCLK: U_Camera (J1_U_Camera#1.8), U_Camera (J1_U_Camera#2.8), Xcore10 (U7.77)
CIM_VSYN: U_Camera (J1_U_Camera#1.18), U_Camera (J1_U_Camera#2.18), Xcore10 (U7.79)
CLK32K: Halley2 (IC1.2), WiFi_BLE2 (R21.2), Xcore10 (U7.33)
CODEC_PWMN: Audio (C3.1), Halley2 (IC1.12), Xcore10 (U7.51)
CODEC_PWMP: Audio (C2.1), Halley2 (IC1.11), Xcore10 (U7.50)
DMIC0_DATA: DMIC_LED (U2.5 U3.5), Halley2 (IC1.93), Xcore10 (U7.13)
DMIC1_DATA: DMIC_LED (U4.5 U5.5), Halley2 (IC1.71), Xcore10 (U7.29)
DMIC_CLK: DMIC_LED (U2.4 U3.4 U4.4 U5.4), Halley2 (IC1.94), Xcore10 (U7.30)
DVP_PWDN: U_Camera (J1_U_Camera#1.17), U_Camera (J1_U_Camera#2.17), Halley2 (IC1.38), Xcore10 (U7.75)
DVP_RESET: U_Camera (J1_U_Camera#1.19), U_Camera (J1_U_Camera#2.19), Halley2 (IC1.42), Xcore10 (U7.76)
HOST_WAKE_BT: WiFi_BLE2 (U6.P6), Xcore10 (U7.103)
LED_Red: Halley2 (IC1.78), Xcore10 (U7.18)
MSC0_CLK: Halley2 (IC1.54), Xcore10 (U7.87)
MSC0_CMD: Halley2 (IC1.55), Xcore10 (U7.88)
MSC0_D0: Halley2 (IC1.53), Xcore10 (U7.86)
MSC0_D1: Halley2 (IC1.52), Xcore10 (U7.85)
MSC0_D2: Halley2 (IC1.51), Xcore10 (U7.90)
MSC0_D3: Halley2 (IC1.50), Xcore10 (U7.89)
MSC1_CLK: WiFi_BLE2 (R17.1 U6.P17), Xcore10 (U7.8)
MSC1_CMD: WiFi_BLE2 (R18.1 U6.P16), Xcore10 (U7.9)
MSC1_D0: WiFi_BLE2 (R16.1 U6.P18), Xcore10 (U7.7)
MSC1_D1: WiFi_BLE2 (R15.1 U6.P19), Xcore10 (U7.6)
MSC1_D2: WiFi_BLE2 (R20.1 U6.P14), Xcore10 (U7.11)
MSC1_D3: WiFi_BLE2 (R19.1 U6.P15), Xcore10 (U7.10)
OTG_DM: Halley2 (IC1.5), USB (USB1.2), Xcore10 (U7.47)
OTG_DP: Halley2 (IC1.6), USB (USB1.3), Xcore10 (U7.48)
OTG_ID: Halley2 (IC1.4), Xcore10 (U7.46)
PCM_CLK: WiFi_BLE2 (U6.P26), Xcore10 (U7.4)
PCM_DI: WiFi_BLE2 (U6.P25), Xcore10 (U7.5)
PCM_DO: WiFi_BLE2 (U6.P27), Xcore10 (U7.2)
PCM_SYN: WiFi_BLE2 (U6.P28), Xcore10 (U7.3)
PWR_ON: Power (RT1.3), Xcore10 (U7.37)
RESET_N: Halley2 (IC1.1), Power (S3.1), Xcore10 (U7.36)
SDCARD_CD: Halley2 (IC1.80), Xcore10 (U7.19)
SMB0_SCL: U_Camera (J1_U_Camera#1.20 R7_U_Camera#1.1), U_Camera (J1_U_Camera#2.20 R7_U_Camera#2.1), Halley2 (IC1.75), Xcore10 (U7.15)
SMB0_SDA: U_Camera (J1_U_Camera#1.22 R6_U_Camera#1.1), U_Camera (J1_U_Camera#2.22 R6_U_Camera#2.1), Halley2 (IC1.74), Xcore10 (U7.14)
SMB1_SCL/PA00: Halley2 (IC1.29), Port (P3.6), Xcore10 (U7.69)
SMB1_SCL/PWM1/PC26: Halley2 (IC1.77), Port (P2.2), Xcore10 (U7.17)
SMB1_SDA/PA01: Halley2 (IC1.28), Port (P3.5), Xcore10 (U7.70)
SMB1_SDA/PWM2/PC27: Halley2 (IC1.76), Port (P2.1), Xcore10 (U7.16)
SSI0_CE0: Halley2 (IC1.87), Port (P2.6), Xcore10 (U7.23)
SSI0_CLK: Halley2 (IC1.86), Port (P2.5), Xcore10 (U7.22)
SSI0_DR: Halley2 (IC1.85), Port (P2.4), Xcore10 (U7.21)
SSI0_DT: DMIC_LED (D1.3), Halley2 (IC1.84), Port (P2.3), Xcore10 (U7.20)
UART0_CTS_N: WiFi_BLE2 (U6.P44), Xcore10 (U7.100)
UART0_RTS_N: WiFi_BLE2 (U6.P41), Xcore10 (U7.99)
UART0_RXD: WiFi_BLE2 (U6.P42), Xcore10 (U7.98)
UART0_TXD: WiFi_BLE2 (U6.P43), Xcore10 (U7.97)
UART1_RXD/PA04: Halley2 (IC1.37), Port (P3.2), Xcore10 (U7.73)
UART1_TXD/PA05: Halley2 (IC1.41), Port (P3.1), Xcore10 (U7.74)
UART2_RXD: Halley2 (IC1.72 IC1.83), Port (P4.1), Xcore10 (U7.31)
UART2_RXD/PA02: Halley2 (IC1.32), Port (P3.4), Xcore10 (U7.71)
UART2_TXD: Halley2 (IC1.73 IC1.82), Port (P4.2), Xcore10 (U7.32)
UART2_TXD/PA03: Halley2 (IC1.31), Port (P3.3), Xcore10 (U7.72)
WAKE_UP: Halley2 (IC1.65), Power (S4.1), Xcore10 (U7.35)
WL_REG_EN: WiFi_BLE2 (U6.P12), Xcore10 (U7.105)
WL_WAKE_HOST: WiFi_BLE2 (U6.P13), Xcore10 (U7.106)